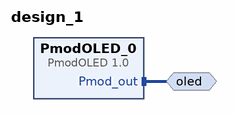
[diagram p0: block diagram of the top level]
# Vivado block design design_1, xc7a200tsbg484-1, Vivado 2021.2
create_bd_design design_1

create_bd_intf_port -mode Master -vlnv digilentinc.com:interface:pmod_rtl:1.0 oled

create_bd_cell -type ip -vlnv digilentinc.com:IP:PmodOLED:1.0 PmodOLED_0
set_property -dict {CONFIG.PMOD oled CONFIG.USE_BOARD_FLOW true} [get_bd_cells PmodOLED_0]

# ---- connections ----

connect_bd_intf_net [get_bd_intf_ports oled] [get_bd_intf_pins PmodOLED_0/Pmod_out]

validate_bd_design
save_bd_design
